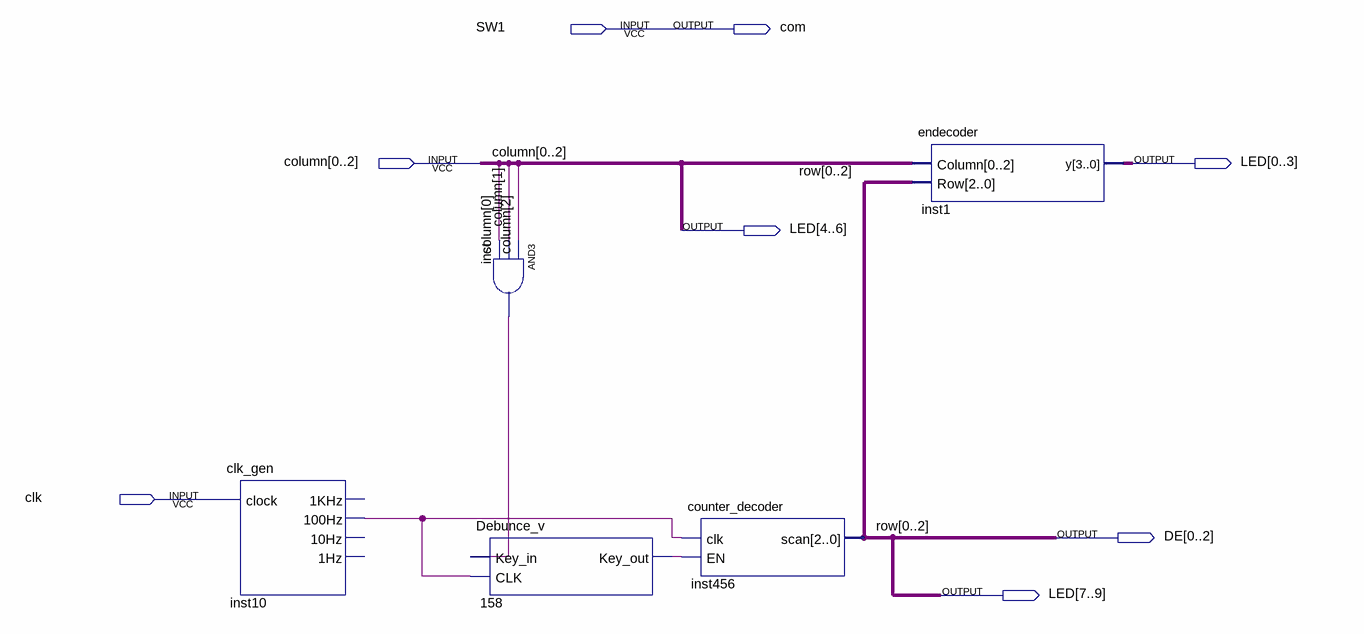
[diagram p0: schematic sheet]
// Quartus schematic test.bdf as structural Verilog: 5 symbols, 8 pins
module test (
  input  SW1,
  input  [0:2] column,
  input  clk,
  output com,
  output [0:9] LED,
  output [0:2] DE
);

  wire inst10_100hz, inst_out, n158_key_out;

  clk_gen inst10 (.clock(clk), .\100Hz (inst10_100hz));  // open: 1KHz, 10Hz, 1Hz
  and inst (inst_out, column[2], column[1], column[0]);
  Debunce_v u_158 (.Key_in(inst_out), .CLK(inst10_100hz), .Key_out(n158_key_out));
  counter_decoder inst456 (.clk(inst10_100hz), .EN(n158_key_out), .scan(DE));
  endecoder inst1 (.Column(column), .Row(DE), .y(LED[0:3]));

  assign com = SW1;
  assign LED[4:9] = {column, DE};

  // Other names for the same wires on the sheet: row[2:0] = {DE[2], DE[1], DE[0]}
endmodule
